# EAGLE design leaf-heater-element-rev1 (EAGLE 9.0.0)
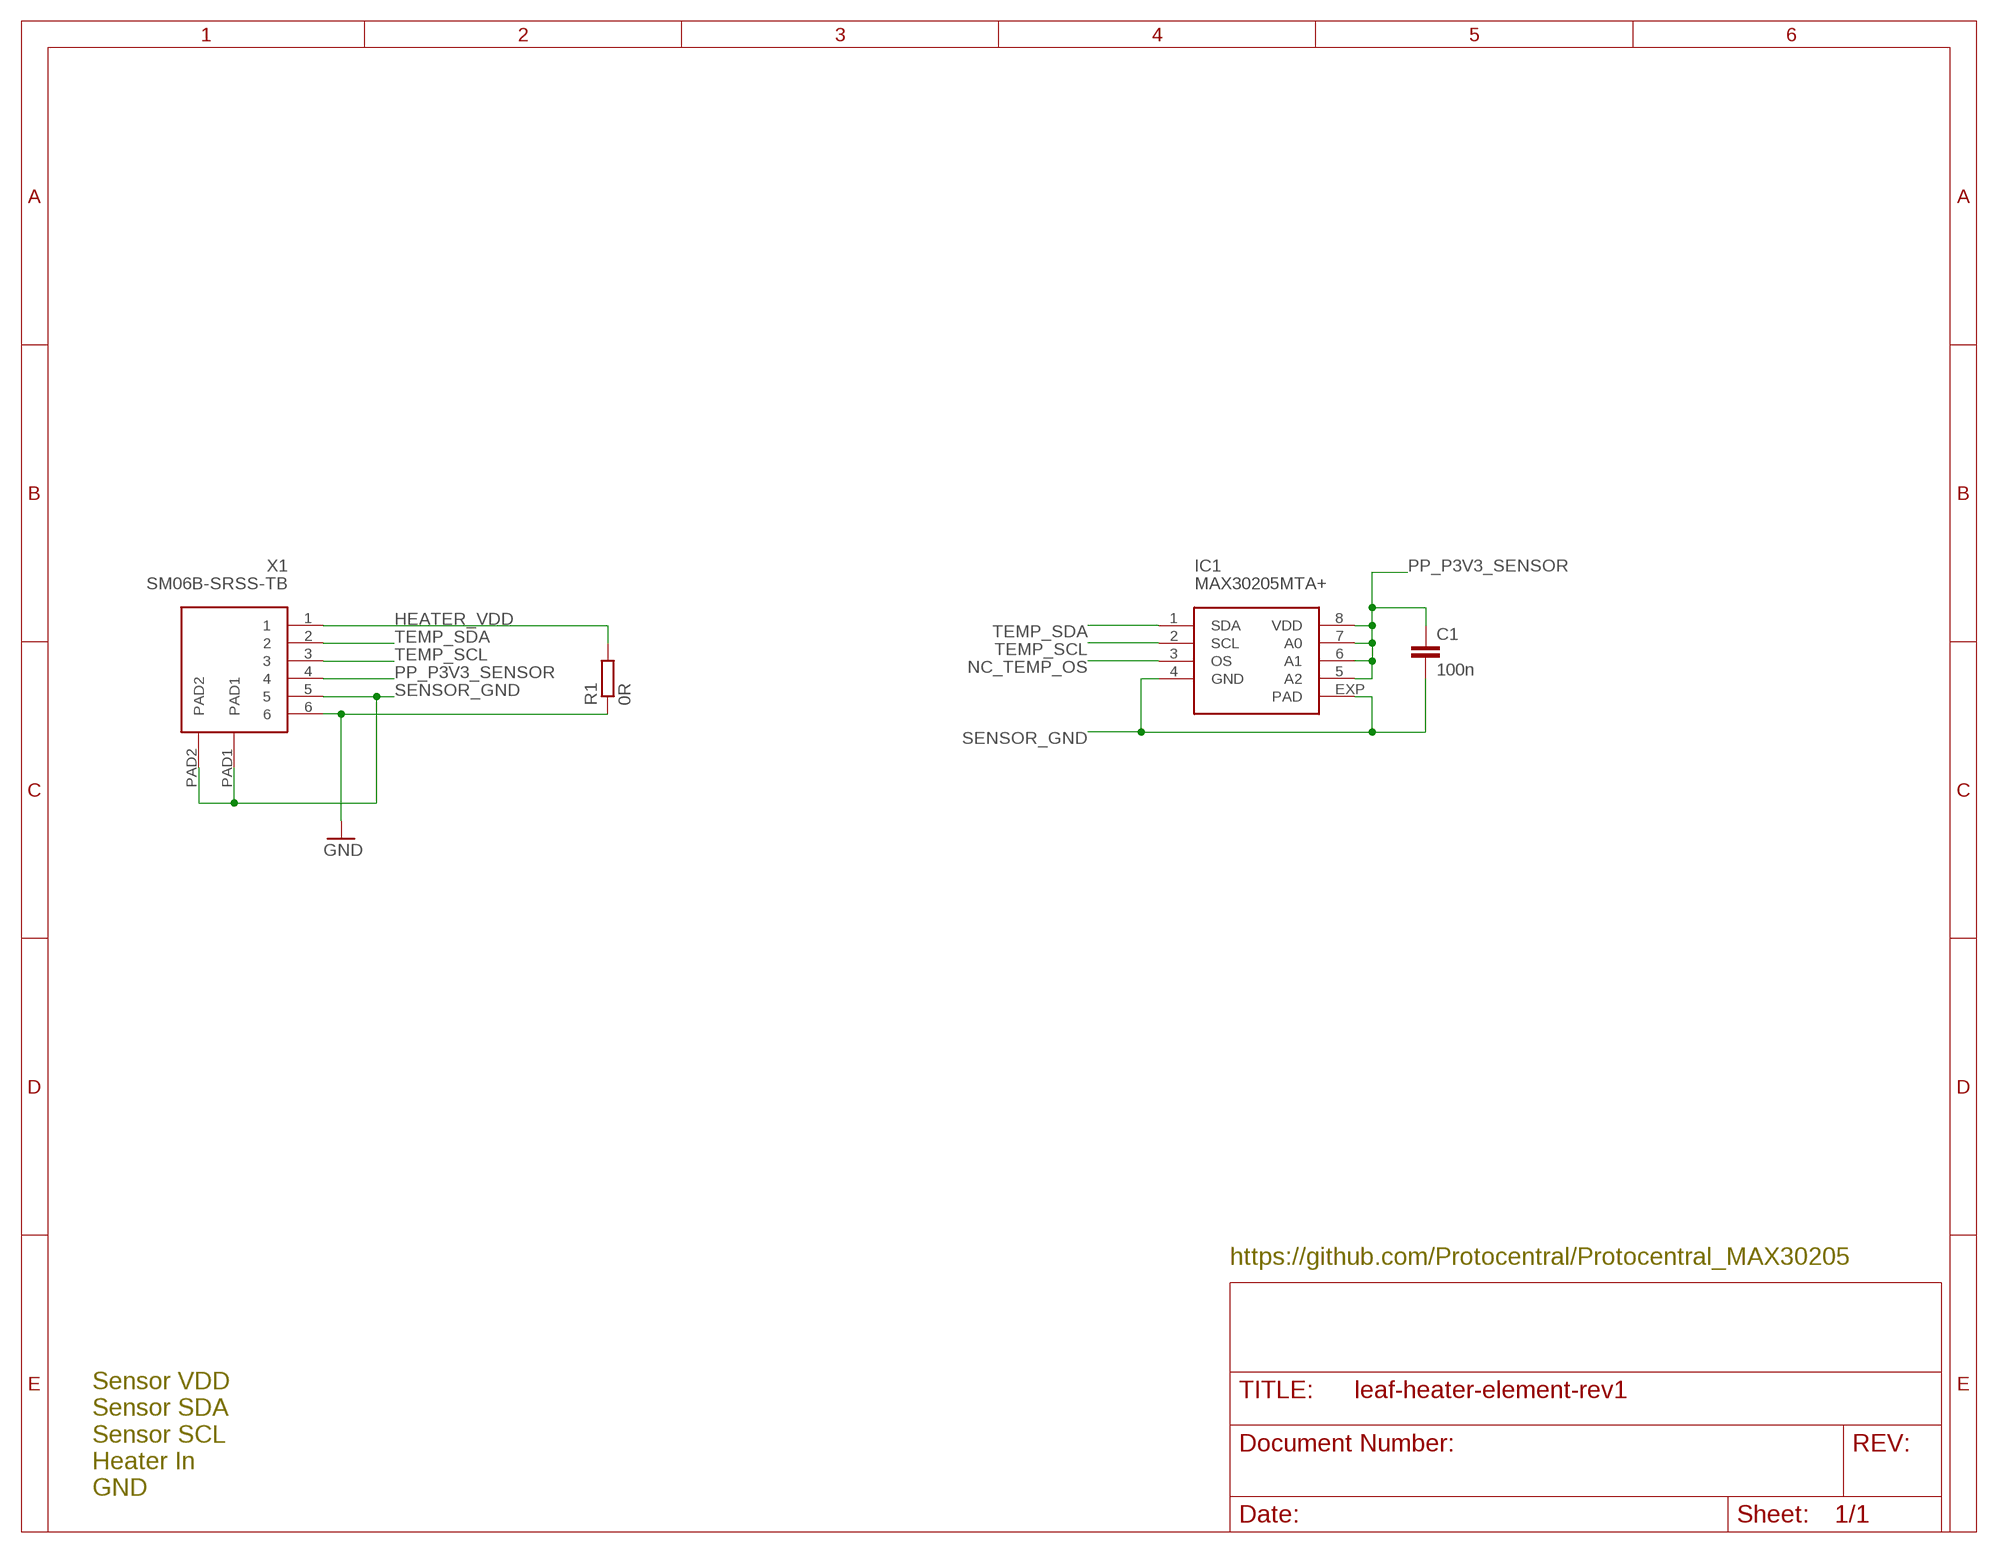
[diagram p0: schematic, sheet 1]

## Parts
C1  100n  C-EUC0402  [C0402]
IC1  MAX30205MTA+  [TDFN-08]
R1  0R  R-EU_R0603  [R0603]
X1  SM06B-SRSS-TB  JST-SH-6PIN  [JST-SM06B-SRSS-TB]

## Nets
GND: R1.1 X1.6
HEATER_VDD: R1.2 X1.1
NC_TEMP_OS: IC1.3(OS)
PP_P3V3_SENSOR: C1.1 IC1.5(A2) IC1.6(A1) IC1.7(A0) IC1.8(VDD) X1.4
SENSOR_GND: C1.2 IC1.4(GND) IC1.EXP(PAD) X1.5 X1.PAD1 X1.PAD2
TEMP_SCL: IC1.2(SCL) X1.3
TEMP_SDA: IC1.1(SDA) X1.2

## Notes on the sheet
- https://github.com/Protocentral/Protocentral_MAX30205
- Sensor VDD
  Sensor SDA
  Sensor SCL
  Heater In
  GND

## Library data of the parts
C1 = rcl:C-EU: CAPACITOR, European symbol
IC1 = meng-plant-raman:MAX30205
R1 = rcl:R-EU_: RESISTOR, European symbol
X1 = meng-plant-raman:JST-SH-6PIN

## Board
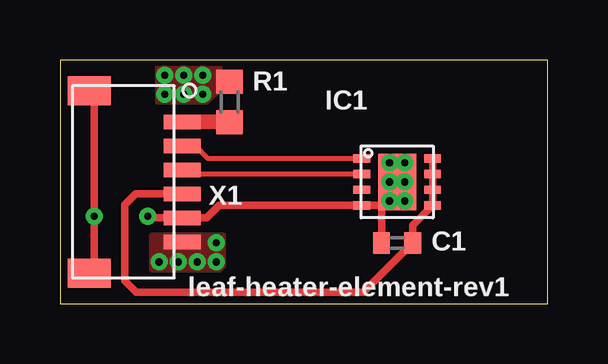
[diagram p1: board, top side]
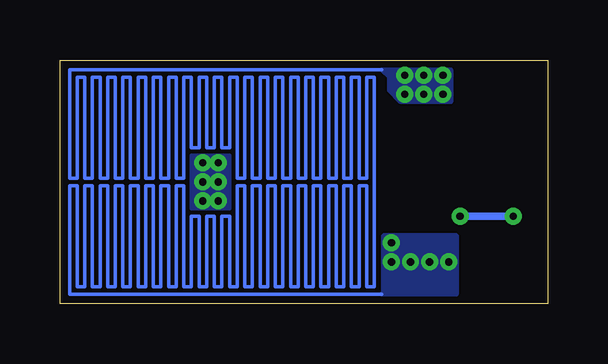
[diagram p2: board, bottom side, seen from below]

Size 20.32 x 10.16 mm. Coordinates in mm from the lower left corner, seen from the top.
Outline: 0,0 20.32,0 20.32,10.16 0,10.16 0,0
Copper layers (1*16): Top 0.035mm / dielectric 1.5mm / Bottom 0.035mm
Design rules "default *": minimum track width 6mil, minimum drill 0.3mm, track to track 6mil, track to pad 6mil, pad to pad 6mil, via to via 6mil, smd to smd 6mil, copper to edge 0.25mm, drill to drill 6mil, minimum pad ring 10mil, minimum via ring 8mil, stop-mask expansion 4mil, vias tented up to drill 12mil, thermal gap 10mil

### Footprints (pad centres in the part's own frame; a part is rotated, then mirrored left to right if it is on the bottom)
C0402 = smd 0.7 x 0.9: 1 -0.65,0; 2 0.65,0
TDFN-08 = smd 0.7 x 0.35: 1 -1.475,0.975; 2 -1.475,0.325; 3 -1.475,-0.325; 4 -1.475,-0.975; 5 1.475,-0.975; 6 1.475,-0.325; 7 1.475,0.325; 8 1.475,0.975 | smd 1.58 x 2.35: EXP 0,0
R0603 = smd 1 x 1.1: 1 -0.85,0; 2 0.85,0
JST-SM06B-SRSS-TB = smd 0.6 x 1.55: 1 -2.5,4.775; 2 -1.5,4.775; 3 -0.5,4.775; 4 0.5,4.775; 5 1.5,4.775; 6 2.5,4.775 | smd 1.2 x 1.8: PAD1 3.8,0.9; PAD2 -3.8,0.9

### Placement (x,y rotation side)
C1  14.05,2.54 180 top
IC1  14.05,5.08 0 top
R1  7.06,8.41 270 top
X1  0.32,5.08 270 top

### Tracks (layer width: path | path; a pad name or v marks a point on that pad's centre or on a via)
GND  (via drill 0.3)
  Bottom 0.152: 6.91,9.76 19.92,9.76 19.92,5.24 19.61,5.24 19.61,9.45 19.29,9.45 19.29,5.24 18.97,5.24 18.97,9.45 18.65,9.45 18.65,5.24 18.34,5.24 18.34,9.45 18.02,9.45 18.02,5.24 17.7,5.24 17.7,9.45 17.38,9.45 17.38,5.24 17.07,5.24 17.07,9.45 16.75,9.45 16.75,5.24 16.43,5.24 16.43,9.45 16.11,9.45 16.11,5.24 15.8,5.24 15.8,9.45 15.48,9.45 15.48,5.24 15.16,5.24 15.16,9.45 14.84,9.45 14.84,6.51 14.53,6.51 14.53,9.45 14.21,9.45 14.21,6.51 13.89,6.51 13.89,9.45 13.57,9.45 13.57,6.51 13.26,6.51 13.26,9.45 12.94,9.45 12.94,5.24 12.62,5.24 12.62,9.45 12.3,9.45 12.3,5.24 11.99,5.24 11.99,9.45 11.67,9.45 11.67,5.24 11.35,5.24 11.35,9.45 11.03,9.45 11.03,5.24 10.72,5.24 10.72,9.45 10.4,9.45 10.4,5.24 10.08,5.24 10.08,9.45 9.76,9.45 9.76,5.24 9.45,5.24 9.45,9.45 9.13,9.45 9.13,5.24 8.81,5.24 8.81,9.45 8.49,9.45 8.49,5.24 8.18,5.24 8.18,9.45 7.86,9.45 7.86,5.24 7.54,5.24 7.54,9.45 7.22,9.45 7.22,0.71 7.54,0.71 7.54,4.92 7.86,4.92 7.86,0.71 8.18,0.71 8.18,4.92 8.49,4.92 8.49,0.71 8.81,0.71 8.81,4.92 9.13,4.92 9.13,0.71 9.45,0.71 9.45,4.92 9.76,4.92 9.76,0.71 10.08,0.71 10.08,4.92 10.4,4.92 10.4,0.71 10.72,0.71 10.72,4.92 11.03,4.92 11.03,0.71 11.35,0.71 11.35,4.92 11.67,4.92 11.67,0.71 11.99,0.71 11.99,4.92 12.3,4.92 12.3,0.71 12.62,0.71 12.62,4.92 12.94,4.92 12.94,0.71 13.26,0.71 13.26,3.65 13.57,3.65 13.57,0.71 13.89,0.71 13.89,3.65 14.21,3.65 14.21,0.71 14.53,0.71 14.53,3.65 14.84,3.65 14.84,0.71 15.16,0.71 15.16,4.92 15.48,4.92 15.48,0.71 15.8,0.71 15.8,4.92 16.11,4.92 16.11,0.71 16.43,0.71 16.43,4.92 16.75,4.92 16.75,0.71 17.07,0.71 17.07,4.92 17.38,4.92 17.38,0.71 17.7,0.71 17.7,4.92 18.02,4.92 18.02,0.71 18.34,0.71 18.34,4.92 18.65,4.92 18.65,0.71 18.97,0.71 18.97,4.92 19.29,4.92 19.29,0.71 19.61,0.71 19.61,4.92 19.92,4.92 19.92,0.4 6.91,0.4
  other vias: 6.51,2.54 6.51,1.75 5.71,1.75 4.92,1.75 4.13,1.75 5.95,9.53 5.95,8.73 5.16,8.73 5.16,9.53 4.37,9.53 4.37,8.73
  pour Top (no thermals): 4.05,9.84 4.05,8.41 6.11,8.41 6.67,8.97 6.67,9.84
  pour Bottom (no thermals): 4.05,9.76 4.05,8.41 6.11,8.41 6.59,8.89 6.59,9.45 6.91,9.76
  pour Top (no thermals): 3.81,2.86 3.81,1.43 6.67,1.43 6.83,1.59 6.83,2.86 3.97,2.86
  pour Bottom (no thermals): 3.81,2.86 3.81,0.4 6.91,0.4 6.83,0.48 6.83,2.86
HEATER_VDD
  Top 0.61: X1.1 7.05,7.58 R1.2
PP_P3V3_SENSOR
  Top 0.305: IC1.8 IC1.7 IC1.6 IC1.5 14.7,3.28 C1.1 12.64,0.48 3.17,0.48 2.7,0.95 2.7,4.13 3.15,4.58 X1.4
SENSOR_GND  (via drill 0.3)
  Top 0.203: IC1.EXP v14.37,5.08
  Top 0.305: C1.2 13.4,3.95 13.41,3.97 | 13.41,3.97 v13.73,4.29 | 13.41,3.97 13.28,4.11 IC1.4 6.64,4.11 6.12,3.58 X1.5 3.72,3.58 v3.65,3.65 | X1.PAD1 1.43,1.49 v1.43,3.65 1.43,8.67 X1.PAD2
  Bottom 0.305: v3.65,3.65 v1.43,3.65
  other vias: 13.73,5.87 14.37,5.87 13.73,5.08 14.37,4.29
  pour Bottom: 13.26,6.19 13.26,3.97 14.84,3.97 14.84,6.19
TEMP_SCL
  Top 0.203: IC1.2 5.41,5.41 5.23,5.58 X1.3
TEMP_SDA
  Top 0.203: IC1.1 6.17,6.05 5.65,6.58 X1.2

### Text on the board
tPlace: leaf-heater-element-rev1